# Altium schematic sheet Therm_power.SchDoc
size A; SheetNumber: 8; SheetTotal: 8
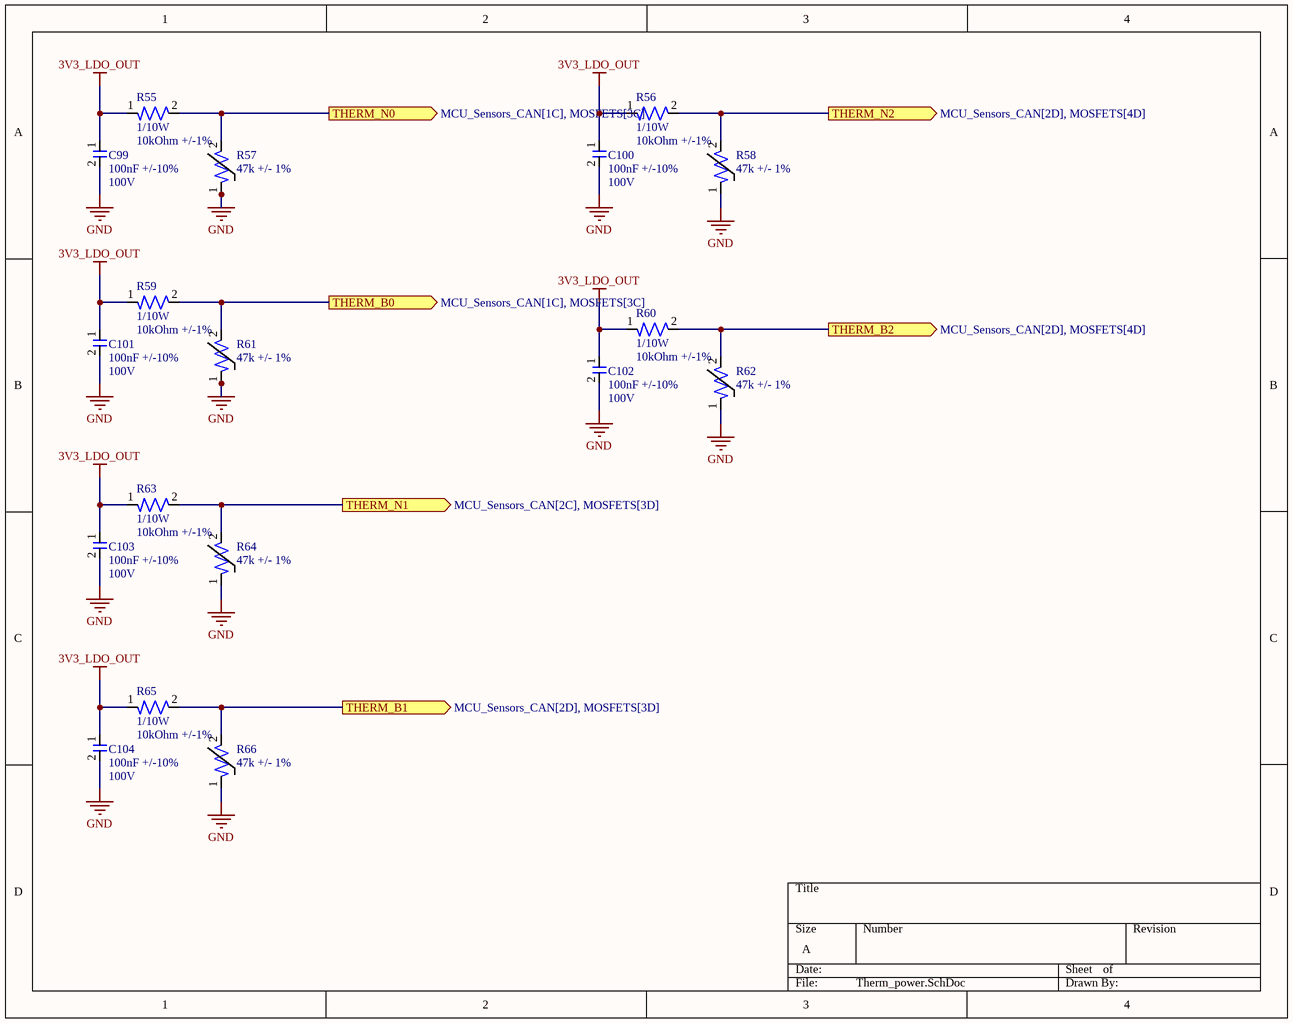
[diagram p0: Therm_power.SchDoc]

## Parts
C99  Capacitance: 100nF +/-10%  Voltage Rating: 100V  [CAP-0603]  (hidden comment: CC0603KRX7R0BB104)
C100  Capacitance: 100nF +/-10%  Voltage Rating: 100V  [CAP-0603]  (hidden comment: CC0603KRX7R0BB104)
C101  Capacitance: 100nF +/-10%  Voltage Rating: 100V  [CAP-0603]  (hidden comment: CC0603KRX7R0BB104)
C102  Capacitance: 100nF +/-10%  Voltage Rating: 100V  [CAP-0603]  (hidden comment: CC0603KRX7R0BB104)
C103  Capacitance: 100nF +/-10%  Voltage Rating: 100V  [CAP-0603]  (hidden comment: CC0603KRX7R0BB104)
C104  Capacitance: 100nF +/-10%  Voltage Rating: 100V  [CAP-0603]  (hidden comment: CC0603KRX7R0BB104)
R55  Power Rating: 1/10W  Resistance: 10kOhm +/-1%  [RES-0603]  (hidden comment: RC0603FR-0710KP)
R56  Power Rating: 1/10W  Resistance: 10kOhm +/-1%  [RES-0603]  (hidden comment: RC0603FR-0710KP)
R57  Resistance: 47k +/- 1%  [RES-0402]  (hidden comment: TMP6431DECR)
R58  Resistance: 47k +/- 1%  [RES-0402]  (hidden comment: TMP6431DECR)
R59  Power Rating: 1/10W  Resistance: 10kOhm +/-1%  [RES-0603]  (hidden comment: RC0603FR-0710KP)
R60  Power Rating: 1/10W  Resistance: 10kOhm +/-1%  [RES-0603]  (hidden comment: RC0603FR-0710KP)
R61  Resistance: 47k +/- 1%  [RES-0402]  (hidden comment: TMP6431DECR)
R62  Resistance: 47k +/- 1%  [RES-0402]  (hidden comment: TMP6431DECR)
R63  Power Rating: 1/10W  Resistance: 10kOhm +/-1%  [RES-0603]  (hidden comment: RC0603FR-0710KP)
R64  Resistance: 47k +/- 1%  [RES-0402]  (hidden comment: TMP6431DECR)
R65  Power Rating: 1/10W  Resistance: 10kOhm +/-1%  [RES-0603]  (hidden comment: RC0603FR-0710KP)
R66  Resistance: 47k +/- 1%  [RES-0402]  (hidden comment: TMP6431DECR)

## Ports
THERM_B0 (out, see MCU_Sensors_CAN[1C], MOSFETS[3C]), THERM_B1 (out, see MCU_Sensors_CAN[2D], MOSFETS[3D]), THERM_B2 (out, see MCU_Sensors_CAN[2D], MOSFETS[4D]), THERM_N0 (out, see MCU_Sensors_CAN[1C], MOSFETS[3C]), THERM_N1 (out, see MCU_Sensors_CAN[2C], MOSFETS[3D]), THERM_N2 (out, see MCU_Sensors_CAN[2D], MOSFETS[4D])

## Nets
3V3_LDO_OUT: C99.1 C100.1 C101.1 C102.1 C103.1 C104.1 R55.1 R56.1 R59.1 R60.1 R63.1 R65.1
GND: C99.2 C100.2 C101.2 C102.2 C103.2 C104.2 R57.1 R58.1 R61.1 R62.1 R64.1 R66.1
THERM_B0: R59.2 R61.2 ; port THERM_B0
THERM_B1: R65.2 R66.2 ; port THERM_B1
THERM_B2: R60.2 R62.2 ; port THERM_B2
THERM_N0: R55.2 R57.2 ; port THERM_N0
THERM_N1: R63.2 R64.2 ; port THERM_N1
THERM_N2: R56.2 R58.2 ; port THERM_N2

## Library data of the parts
C99-C104 = CAP-100N-0001: CAP CER 0.1UF 100V X7R 0603; Manufacturer: YAGEO; Assembled?: no; Manufacturer Part Number: CC0603KRX7R0BB104; Temperature Coefficient: X7R; Package Size: 0603
R55 R56 R59 R60 R63 R65 = RES-10K-0002: RES SMD 10K OHM 1% 1/10W 0603; Manufacturer: YAGEO; Assembled?: no; Manufacturer Part Number: RC0603FR-0710KP; Package Size: 0603
R57 R58 R61 R62 R64 R66 = THERM-47K-0001: PTC Thermistor 47 kOhms 0402 (1006 Metric); Manufacturer: Texas Instruments; Manufacturer Part Number: TMP6431DECR; Package Size: 0402